# EAGLE schematic aw_201_clock (EAGLE 6.4)
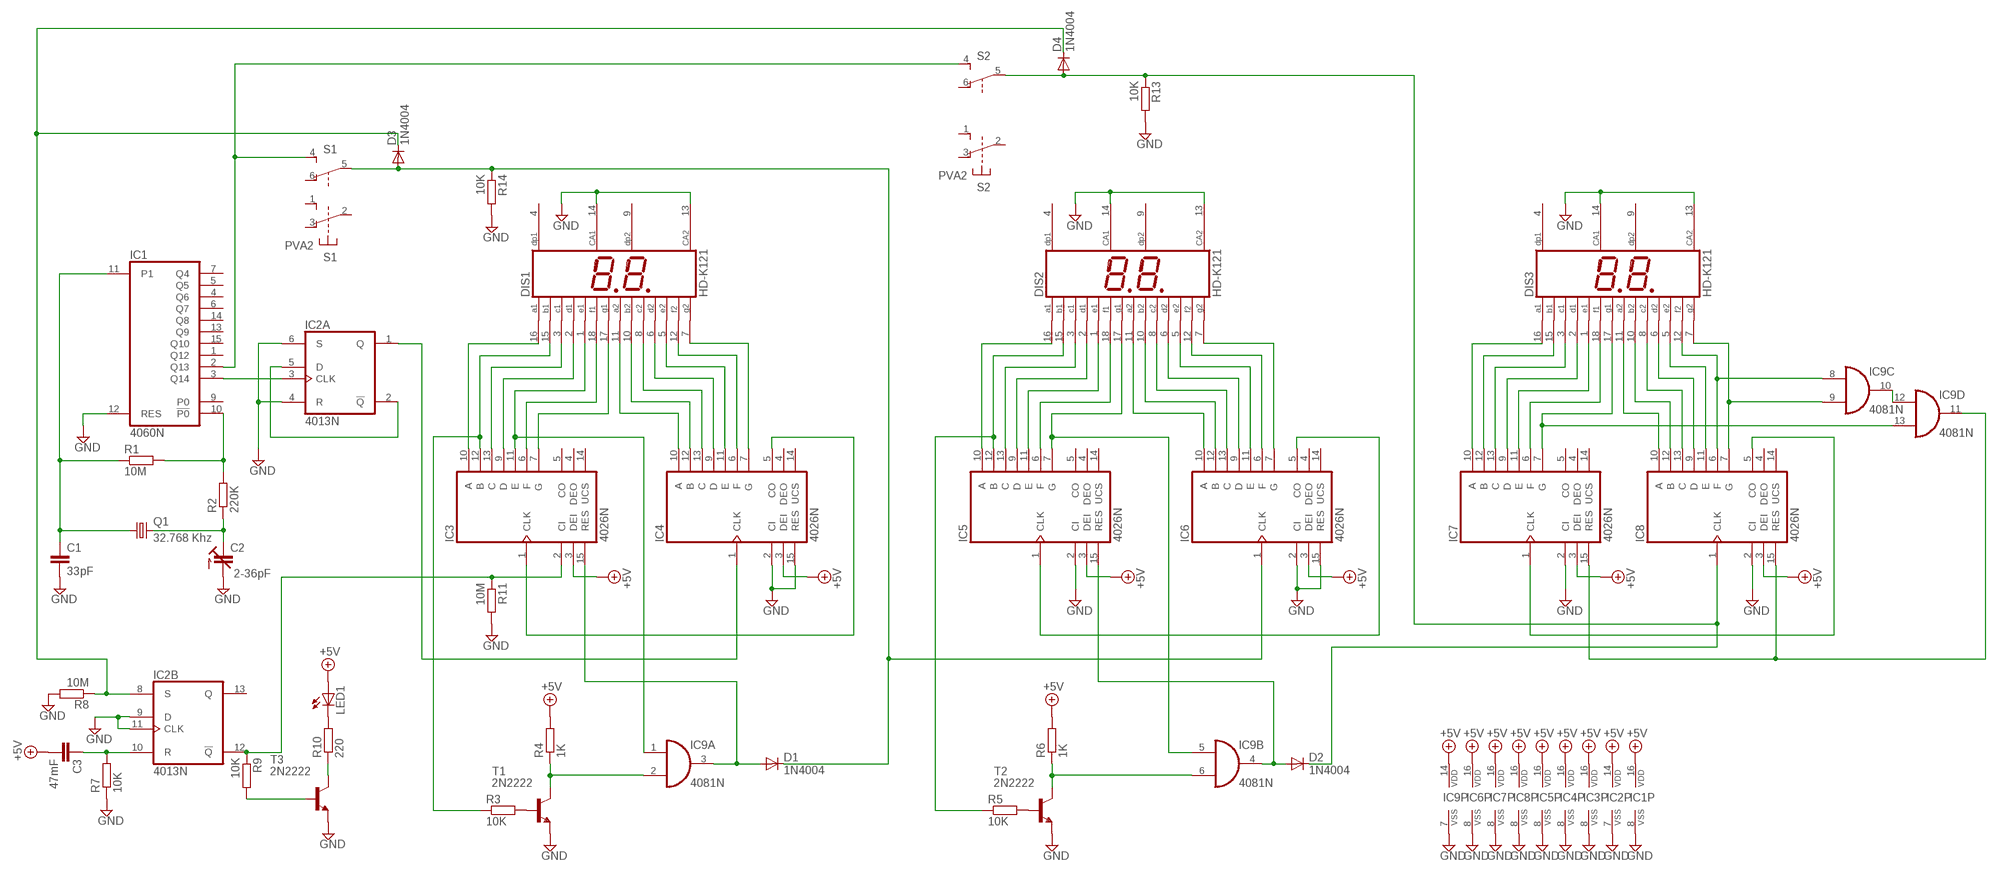
[diagram p0: schematic, sheet 1]

## Parts
C1  33pF  C-EU050-024X044  [C050-024X044]
C2  2-36pF  C-TRIMM3050.504  [CTRIM3050.504]
C3  47mF  C-EU050-024X044  [C050-024X044]
D1  1N4004  [DO41-10]
D2  1N4004  [DO41-10]
D3  1N4004  [DO41-10]
D4  1N4004  [DO41-10]
DIS1  HD-K121  [HDSP-R]
DIS2  HD-K121  [HDSP-R]
DIS3  HD-K121  [HDSP-R]
IC1  4060N  [DIL16]
IC2  4013N  [DIL14]
IC3  4026N  [DIL16]
IC4  4026N  [DIL16]
IC5  4026N  [DIL16]
IC6  4026N  [DIL16]
IC7  4026N  [DIL16]
IC8  4026N  [DIL16]
IC9  4081N  [DIL14]
LED1  LED5MM  [LED5MM]
Q1  32.768 Khz  CRYSTALTC26V  [TC26V]
R1  10M  R-EU_0207/10  [0207/10]
R2  220K  R-EU_0207/10  [0207/10]
R3  10K  R-EU_0207/10  [0207/10]
R4  1K  R-EU_0207/10  [0207/10]
R5  10K  R-EU_0207/10  [0207/10]
R6  1K  R-EU_0207/10  [0207/10]
R7  10K  R-EU_0207/10  [0207/10]
R8  10M  R-EU_0207/10  [0207/10]
R9  10K  R-EU_0207/10  [0207/10]
R10  220  R-EU_0207/10  [0207/10]
R11  10M  R-EU_0207/10  [0207/10]
R13  10K  R-EU_0207/10  [0207/10]
R14  10K  R-EU_0207/10  [0207/10]
S1  PVA2  [PVA2F]
S2  PVA2  [PVA2F]
T1  2N2222  [TO18]
T2  2N2222  [TO18]
T3  2N2222  [TO18]

## Nets
+5V: C3.2 IC1.16(VDD) IC2.14(P:VDD) IC3.3(DEI) IC3.16(VDD) IC4.3(DEI) IC4.16(VDD) IC5.3(DEI) IC5.16(VDD) IC6.3(DEI) IC6.16(VDD) IC7.3(DEI) IC7.16(VDD) IC8.3(DEI) IC8.16(VDD) IC9.14(P:VDD) LED1.A R4.2 R6.2
GND: C1.2 C2.2(A) DIS1.13(CA2) DIS1.14(CA1) DIS2.13(CA2) DIS2.14(CA1) DIS3.13(CA2) DIS3.14(CA1) IC1.8(VSS) IC1.12(RES) IC2.4(A:R) IC2.6(A:S) IC2.7(P:VSS) IC2.9(B:D) IC2.11(B:CLK) IC3.8(VSS) IC4.2(CI) IC4.8(VSS) IC4.15(RES) IC5.2(CI) IC5.8(VSS) IC6.2(CI) IC6.8(VSS) IC6.15(RES) IC7.2(CI) IC7.8(VSS) IC8.2(CI) IC8.8(VSS) IC9.7(P:VSS) R7.1 R8.2 R11.2 R13.2 R14.2 T1.1(E) T2.1(E) T3.1(E)
N$1: C1.1 IC1.11(P1) Q1.1 R1.1
N$2: IC1.10(!P0) R1.2 R2.2
N$3: C2.1(E) Q1.2 R2.1
N$4: IC2.2(A:!Q) IC2.5(A:D)
N$5: IC1.3(Q14) IC2.3(A:CLK)
N$6: DIS1.11(A2) IC4.10(A)
N$7: DIS1.10(B2) IC4.12(B)
N$8: DIS1.8(C2) IC4.13(C)
N$9: DIS1.6(D2) IC4.9(D)
N$10: DIS1.5(E2) IC4.11(E)
N$11: DIS1.12(F2) IC4.6(F)
N$12: DIS1.7(G2) IC4.7(G)
N$13: DIS1.17(G1) IC3.7(G)
N$14: DIS1.18(F1) IC3.6(F)
N$15: DIS1.1(E1) IC3.11(E) IC9.1(A:I0)
N$16: DIS1.2(D1) IC3.9(D)
N$17: DIS1.3(C1) IC3.13(C)
N$18: DIS1.15(B1) IC3.12(B) R3.1
N$19: DIS1.16(A1) IC3.10(A)
N$20: IC3.1(CLK) IC4.5(CO)
N$21: DIS2.10(B2) IC6.12(B)
N$22: DIS2.8(C2) IC6.13(C)
N$23: DIS2.6(D2) IC6.9(D)
N$24: DIS2.5(E2) IC6.11(E)
N$25: DIS2.12(F2) IC6.6(F)
N$26: DIS2.7(G2) IC6.7(G)
N$27: DIS2.11(A2) IC6.10(A)
N$28: DIS2.17(G1) IC5.7(G) IC9.5(B:I0)
N$29: DIS2.18(F1) IC5.6(F)
N$30: DIS2.1(E1) IC5.11(E)
N$31: DIS2.2(D1) IC5.9(D)
N$32: DIS2.3(C1) IC5.13(C)
N$33: DIS2.15(B1) IC5.12(B) R5.1
N$34: DIS2.16(A1) IC5.10(A)
N$35: IC5.1(CLK) IC6.5(CO)
N$36: DIS3.10(B2) IC8.12(B)
N$37: DIS3.8(C2) IC8.13(C)
N$38: DIS3.6(D2) IC8.9(D)
N$39: DIS3.5(E2) IC8.11(E)
N$40: DIS3.12(F2) IC8.6(F) IC9.8(C:I0)
N$41: DIS3.7(G2) IC8.7(G) IC9.9(C:I1)
N$42: DIS3.11(A2) IC8.10(A)
N$43: DIS3.17(G1) IC7.7(G) IC9.13(D:I1)
N$44: DIS3.18(F1) IC7.6(F)
N$45: DIS3.1(E1) IC7.11(E)
N$46: DIS3.2(D1) IC7.9(D)
N$47: DIS3.3(C1) IC7.13(C)
N$48: DIS3.15(B1) IC7.12(B)
N$49: DIS3.16(A1) IC7.10(A)
N$50: IC7.1(CLK) IC8.5(CO)
N$51: IC2.1(A:Q) IC4.1(CLK)
N$52: IC9.2(A:I1) R4.1 T1.3(C)
N$53: R3.2 T1.2(B)
N$54: IC9.10(C:O) IC9.12(D:I0)
N$55: D1.A IC3.15(RES) IC9.3(A:O)
N$56: IC9.6(B:I1) R6.1 T2.3(C)
N$57: R5.2 T2.2(B)
N$58: C3.1 IC2.10(B:R) R7.2
N$60: D2.C D4.A IC8.1(CLK) R13.1 S2.5(2:P)
N$61: D2.A IC5.15(RES) IC9.4(B:O)
N$62: D3.C D4.C IC2.8(B:S) R8.1
N$63: IC7.15(RES) IC8.15(RES) IC9.11(D:O)
N$64: IC1.2(Q13) S1.4(2:S) S2.4(2:S)
N$65: R9.2 T3.2(B)
N$66: LED1.K(C) R10.2
N$67: R10.1 T3.3(C)
N$68: IC2.12(B:!Q) IC3.2(CI) R9.1 R11.1
N$69: D1.C D3.A IC6.1(CLK) R14.1 S1.5(2:P)
Unconnected: DIS1.4(DP1) DIS1.9(DP2) DIS2.4(DP1) DIS2.9(DP2) DIS3.4(DP1) DIS3.9(DP2) IC1.1(Q12) IC1.4(Q6) IC1.5(Q5) IC1.6(Q7) IC1.7(Q4) IC1.9(P0) IC1.13(Q9) IC1.14(Q8) IC1.15(Q10) IC2.13(B:Q) IC3.4(DEO) IC3.5(CO) IC3.14(UCS) IC4.4(DEO) IC4.14(UCS) IC5.4(DEO) IC5.5(CO) IC5.14(UCS) IC6.4(DEO) IC6.14(UCS) IC7.4(DEO) IC7.5(CO) IC7.14(UCS) IC8.4(DEO) IC8.14(UCS) S1.1(1:S) S1.2(1:P) S1.3(1:O) S1.6(2:O) S2.1(1:S) S2.2(1:P) S2.3(1:O) S2.6(2:O)

## Library data of the parts
C1 C3 = rcl:C-EU: CAPACITOR, European symbol
C2 = rcl:C-TRIMM: Trimm capacitor
D1-D4 = diode:1N4004: DIODE general purpose rectifier, 1 A
DIS1-DIS3 = display-hp:HD-K121: LED DISPLAY 2 x 1 character 7 segment, decimal points right; OC_FARNELL: unknown; OC_NEWARK: unknown
IC1 = 40xx:4060: 14-stage binary/ripple COUNTER
IC2 = 40xx:4013: Dual D FLIP FLOP, set/reset
IC3-IC8 = 40xx:4026: Decade COUNTER/DIVIDER, 7-seg. outputs
IC9 = 40xx:4081: Quad 2-input AND
LED1 = led:LED: LED OSRAM: - CHIPLED LG R971, LG N971, LY N971, LG Q971, LY Q971, LO R971, LY R971 LH N974, LH R974 LS Q976, LO Q976, LY Q976 LO Q996 - Hyper CHIPLED LW Q18S LB Q993, LB Q99A, LB R99A - SideLED LS A670, LO A670, LY A670, LG A670, LP A670 LB A673, LV A673, LT A673, LW A673 LH A674 LY A675 LS A676, LA A676, LO A676, LY A676, LW A676 LS A679, LY A679, LG A679 - Hyper Micro SIDELED® LS Y876, LA Y876, LO Y876, LY Y876 LT Y87S - SmartLED LW L88C, LW L88S LB L89C, LB L89S, LG L890 LS L89K, LO L89K, LY L89K LS L896, LA L896, LO L896, LY L896 - TOPLED LS T670, LO T670, LY T670, LG T670, LP T670 LSG T670, LSP T670, LSY T670, LOP T670, LYG T670 LG T671, LOG T671, LSG T671 LB T673, LV T673, LT T673, LW T673 LH T674 LS T676, LA T676, LO T676, LY T676, LB T676, LH T676, LSB T676, LW T676 LB T67C, LV T67C, LT T67C, LS T67K, LO T67K, LY T67K, LW E67C LS E67B, LA E67B, LO E67B, LY E67B, LB E67C, LV E67C, LT E67C LW T67C LS T679, LY T679, LG T679 LS T770, LO T770, LY T770, LG T770, LP T770 LB T773, LV T773, LT T773, LW T773 LH T774 LS E675, LA E675, LY E675, LS T675 LS T776, LA T776, LO T776, LY T776, LB T776 LHGB T686 LT T68C, LB T68C - Hyper Mini TOPLED® LB M676 - Mini TOPLED Santana® LG M470 LS M47K, LO M47K, LY M47K Source: http://www.osram.convergy.de LUXEON: - LUMILED® LXK2-PW12-R00, LXK2-PW12-S00, LXK2-PW14-U00, LXK2-PW14-V00 LXK2-PM12-R00, LXK2-PM12-S00, LXK2-PM14-U00 LXK2-PE12-Q00, LXK2-PE12-R00, LXK2-PE12-S00, LXK2-PE14-T00, LXK2-PE14-U00 LXK2-PB12-K00, LXK2-PB12-L00, LXK2-PB12-M00, LXK2-PB14-N00, LXK2-PB14-P00, LXK2-PB14-Q00 LXK2-PR12-L00, LXK2-PR12-M00, LXK2-PR14-Q00, LXK2-PR14-R00 LXK2-PD12-Q00, LXK2-PD12-R00, LXK2-PD12-S00 LXK2-PH12-R00, LXK2-PH12-S00 LXK2-PL12-P00, LXK2-PL12-Q00, LXK2-PL12-R00 Source: www.luxeon.com KINGBRIGHT: KA-3528ASYC Source: www.kingbright.com
Q1 = crystal:CRYSTAL: CRYSTAL; OC_FARNELL: unknown; OC_NEWARK: unknown
R1-R11 R13 R14 = resistor:R-EU_: RESISTOR, European symbol
S1 S2 = switch-misc:PVA2: ITT SWITCH
T1-T3 = transistor:2N2222: NPN TRANSISTOR